# EAGLE schematic Audio panel board for 10.4 inch panel with ATMega (EAGLE 9.6.2)
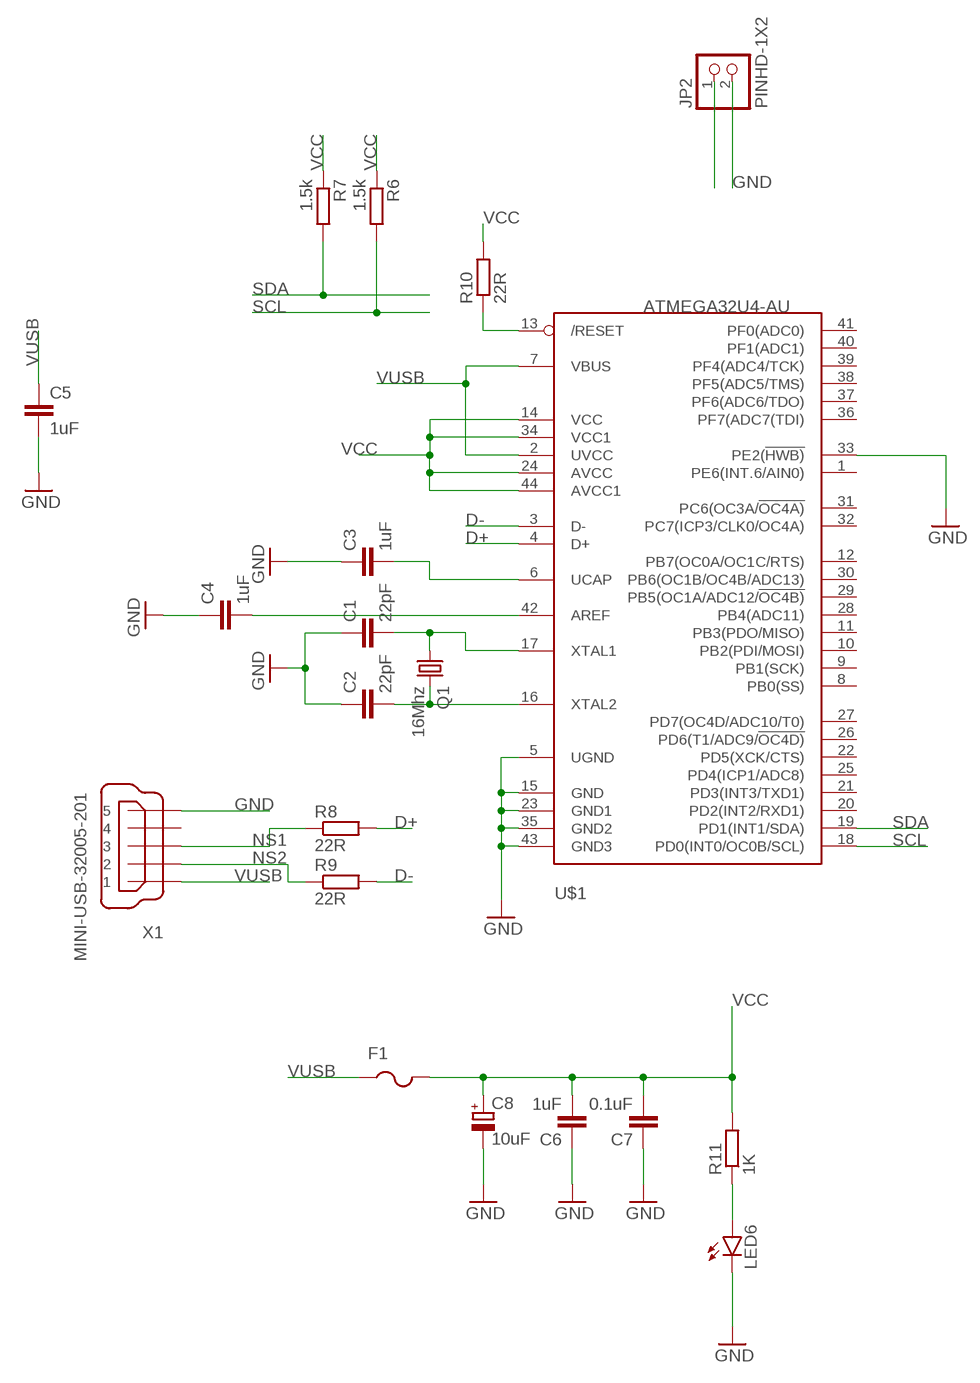
[diagram p0: schematic, sheet 1]

## Parts
C1  22pF  C-EU025-025X050  [C025-025X050]
C2  22pF  C-EU025-025X050  [C025-025X050]
C3  1uF  C-EU025-025X050  [C025-025X050]
C4  1uF  C-EU025-025X050  [C025-025X050]
C5  1uF  C-EU025-025X050  [C025-025X050]
C6  1uF  C-EU025-025X050  [C025-025X050]
C7  0.1uF  C-EU025-025X050  [C025-025X050]
C8  10uF  CPOL-EUE2.5-7  [E2,5-7]
F1  PTCFUSE-1206  [R1206]
JP2  PINHD-1X2  [1X02]
LED6  LEDCHIP-LED0805  [CHIP-LED0805]
Q1  16Mhz  CRYSTALHC49S  [HC49/S]
R6  1.5k  R-EU_R0805  [R0805]
R7  1.5k  R-EU_R0805  [R0805]
R8  22R  R-EU_R0805  [R0805]
R9  22R  R-EU_R0805  [R0805]
R10  22R  R-EU_R0805  [R0805]
R11  1K  R-EU_R0805  [R0805]
U$1  ATMEGA32U4-AU  [TQFP44]
X1  MINI-USB-32005-201  [32005-201]

## Nets
D+: R8.2 U$1.4(D+)
D-: R9.2 U$1.3(D-)
GND: C1.1 C2.1 C3.1 C4.1 C5.2 C6.1 C7.1 C8.- JP2.2 LED6.C U$1.5(UGND) U$1.15(GND) U$1.23(GND1) U$1.33(PE2(!HWB)) U$1.35(GND2) U$1.43(GND3) X1.5
N$16: JP2.1
N$18: C4.2 U$1.42(AREF)
N$19: C2.2 Q1.2 U$1.16(XTAL2)
N$20: C1.2 Q1.1 U$1.17(XTAL1)
N$21: C3.2 U$1.6(UCAP)
N$22: R10.1 U$1.13(/RESET)
N$25: LED6.A R11.1
NS1: R8.1 X1.3
NS2: R9.1 X1.2
SCL: R6.2 U$1.18(PD0(INT0/OC0B/SCL))
SDA: R7.2 U$1.19(PD1(INT1/SDA))
VCC: C6.2 C7.2 C8.+ F1.2 R6.1 R7.1 R10.2 R11.2 U$1.14(VCC) U$1.24(AVCC) U$1.34(VCC1) U$1.44(AVCC1)
VUSB: C5.1 F1.1 U$1.2(UVCC) U$1.7(VBUS) X1.1
Unconnected: U$1.1(PE6(INT.6/AIN0)) U$1.8(PB0(SS)) U$1.9(PB1(SCK)) U$1.10(PB2(PDI/MOSI)) U$1.11(PB3(PDO/MISO)) U$1.12(PB7(OC0A/OC1C/RTS)) U$1.20(PD2(INT2/RXD1)) U$1.21(PD3(INT3/TXD1)) U$1.22(PD5(XCK/CTS)) U$1.25(PD4(ICP1/ADC8)) U$1.26(PD6(T1/ADC9/!OC4D)) U$1.27(PD7(OC4D/ADC10/T0)) U$1.28(PB4(ADC11)) U$1.29(PB5(OC1A/ADC12/!OC4B)) U$1.30(PB6(OC1B/OC4B/ADC13)) U$1.31(PC6(OC3A/!OC4A)) U$1.32(PC7(ICP3/CLK0/OC4A)) U$1.36(PF7(ADC7(TDI)) U$1.37(PF6(ADC6/TDO)) U$1.38(PF5(ADC5/TMS)) U$1.39(PF4(ADC4/TCK)) U$1.40(PF1(ADC1)) U$1.41(PF0(ADC0)) X1.4

## Library data of the parts
C1-C7 = rcl:C-EU: CAPACITOR, European symbol; SPICEPREFIX: C
C8 = rcl:CPOL-EU: POLARIZED CAPACITOR, European symbol; SPICEPREFIX: C
F1 = adafruit:PTCFUSE: PTC fuses, resettable thermistors
JP2 = Connector:PINHD-1X2: PIN HEADER; CATEGORY: CONNECTOR; SUB-CATEGORY: PIN-HEADER
LED6 = led:LED: LED OSRAM: - CHIPLED LG R971, LG N971, LY N971, LG Q971, LY Q971, LO R971, LY R971 LH N974, LH R974 LS Q976, LO Q976, LY Q976 LO Q996 - Hyper CHIPLED LW Q18S LB Q993, LB Q99A, LB R99A - SideLED LS A670, LO A670, LY A670, LG A670, LP A670 LB A673, LV A673, LT A673, LW A673 LH A674 LY A675 LS A676, LA A676, LO A676, LY A676, LW A676 LS A679, LY A679, LG A679 - Hyper Micro SIDELED® LS Y876, LA Y876, LO Y876, LY Y876 LT Y87S - SmartLED LW L88C, LW L88S LB L89C, LB L89S, LG L890 LS L89K, LO L89K, LY L89K LS L896, LA L896, LO L896, LY L896 - TOPLED LS T670, LO T670, LY T670, LG T670, LP T670 LSG T670, LSP T670, LSY T670, LOP T670, LYG T670 LG T671, LOG T671, LSG T671 LB T673, LV T673, LT T673, LW T673 LH T674 LS T676, LA T676, LO T676, LY T676, LB T676, LH T676, LSB T676, LW T676 LB T67C, LV T67C, LT T67C, LS T67K, LO T67K, LY T67K, LW E67C LS E67B, LA E67B, LO E67B, LY E67B, LB E67C, LV E67C, LT E67C LW T67C LS T679, LY T679, LG T679 LS T770, LO T770, LY T770, LG T770, LP T770 LB T773, LV T773, LT T773, LW T773 LH T774 LS E675, LA E675, LY E675, LS T675 LS T776, LA T776, LO T776, LY T776, LB T776 LHGB T686 LT T68C, LB T68C - Hyper Mini TOPLED® LB M676 - Mini TOPLED Santana® LG M470 LS M47K, LO M47K, LY M47K Source: http://www.osram.convergy.de LUXEON: - LUMILED® LXK2-PW12-R00, LXK2-PW12-S00, LXK2-PW14-U00, LXK2-PW14-V00 LXK2-PM12-R00, LXK2-PM12-S00, LXK2-PM14-U00 LXK2-PE12-Q00, LXK2-PE12-R00, LXK2-PE12-S00, LXK2-PE14-T00, LXK2-PE14-U00 LXK2-PB12-K00, LXK2-PB12-L00, LXK2-PB12-M00, LXK2-PB14-N00, LXK2-PB14-P00, LXK2-PB14-Q00 LXK2-PR12-L00, LXK2-PR12-M00, LXK2-PR14-Q00, LXK2-PR14-R00 LXK2-PD12-Q00, LXK2-PD12-R00, LXK2-PD12-S00 LXK2-PH12-R00, LXK2-PH12-S00 LXK2-PL12-P00, LXK2-PL12-Q00, LXK2-PL12-R00 Source: www.luxeon.com KINGBRIGHT: KA-3528ASYC Source: www.kingbright.com
Q1 = adafruit:CRYSTAL: CRYSTAL; OC_FARNELL: 1667008; OC_NEWARK: unknown
R6-R11 = rcl:R-EU_: RESISTOR, European symbol; SPICEPREFIX: R
U$1 = adafruit:ATMEGA32U4: http://www.ladyada.net/library/eagle
X1 = con-cypressindustries:MINI-USB-: MINI USB-B Conector Source: www.cypressindustries.com; OC_FARNELL: unknown; OC_NEWARK: unknown